# EAGLE design arm-board (EAGLE 6.5.0)

## Sheet 1 of 6: Processor
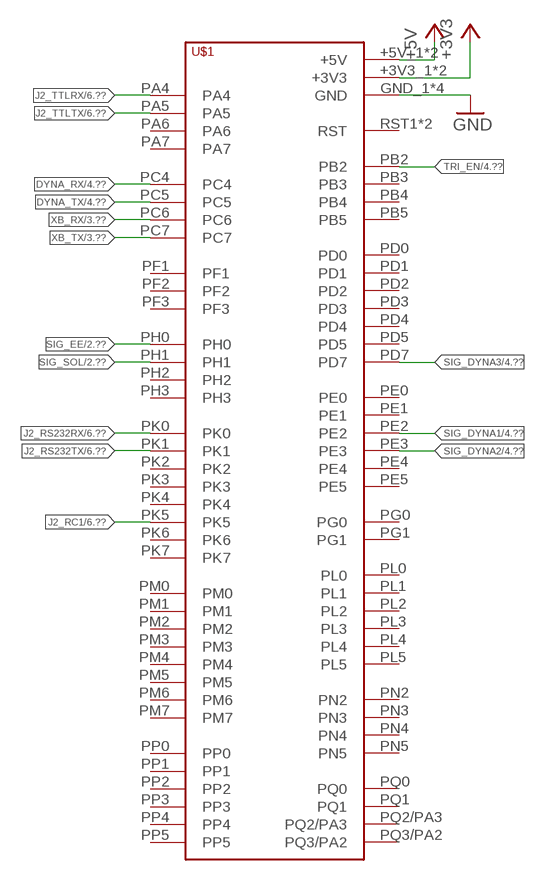
[diagram p0: schematic, sheet 1]

### Parts
U$1  TIVA-C-CONNECTED  [TIVA-C-CONNECTED]

### Nets
+3V3: U$1.+3V3_1(+3V3) U$1.+3V3_2(+3V3) ; also sheet 3
+5V: U$1.+5V_1(+5V) U$1.+5V_2(+5V) ; also sheet 2,4,5,6
DYNA_RX: U$1.PC4 ; also sheet 4
DYNA_TX: U$1.PC5 ; also sheet 4
GND: U$1.GND_1(GND) U$1.GND_2(GND) U$1.GND_3(GND) U$1.GND_4(GND) ; also sheet 2,3,4,5,6
J2_RC1: U$1.PK5 ; also sheet 6
J2_RS232RX: U$1.PK0 ; also sheet 6
J2_RS232TX: U$1.PK1 ; also sheet 6
J2_TTLRX: U$1.PA4 ; also sheet 6
J2_TTLTX: U$1.PA5 ; also sheet 6
SIG_DYNA1: U$1.PE2 ; also sheet 4
SIG_DYNA2: U$1.PE3 ; also sheet 4
SIG_DYNA3: U$1.PD7 ; also sheet 4
SIG_EE: U$1.PH0 ; also sheet 2
SIG_SOL: U$1.PH1 ; also sheet 2
TRI_EN: U$1.PB2 ; also sheet 4
XB_RX: U$1.PC6 ; also sheet 3
XB_TX: U$1.PC7 ; also sheet 3
Unconnected: U$1.PA6 U$1.PA7 U$1.PB3 U$1.PB4 U$1.PB5 U$1.PD0 U$1.PD1 U$1.PD2 U$1.PD3 U$1.PD4 U$1.PD5 U$1.PE0 U$1.PE1 U$1.PE4 U$1.PE5 U$1.PF1 U$1.PF2 U$1.PF3 U$1.PG0 U$1.PG1 U$1.PH2 U$1.PH3 U$1.PK2 U$1.PK3 U$1.PK4 U$1.PK6 U$1.PK7 U$1.PL0 U$1.PL1 U$1.PL2 U$1.PL3 U$1.PL4 U$1.PL5 U$1.PM0 U$1.PM1 U$1.PM2 U$1.PM3 U$1.PM4 U$1.PM5 U$1.PM6 U$1.PM7 U$1.PN2 U$1.PN3 U$1.PN4 U$1.PN5 U$1.PP0 U$1.PP1 U$1.PP2 U$1.PP3 U$1.PP4 U$1.PP5 U$1.PQ0 U$1.PQ1 U$1.PQ2/PA3 U$1.PQ3/PA2 U$1.RST1(RST) U$1.RST_2(RST)

## Sheet 2 of 6: Power
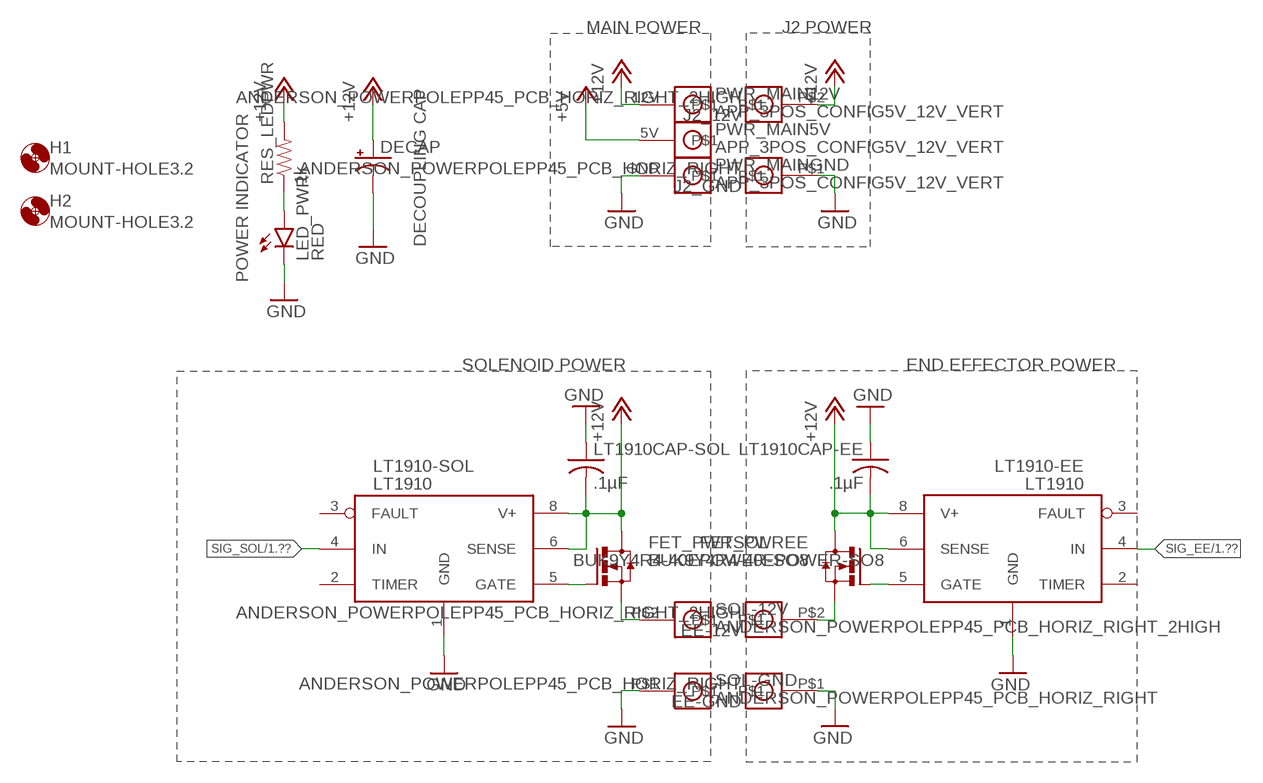
[diagram p1: schematic, sheet 2]

### Parts
DECAP  100UF-25V-20%(PTH)  [CPOL-RADIAL-100UF-25V]
EE-12V  ANDERSON_POWERPOLEPP45_PCB_HORIZ_RIGHT_2HIGH  [APP45_PCB_HORIZ_RIGHT_2HIGH]
EE-GND  ANDERSON_POWERPOLEPP45_PCB_HORIZ_RIGHT  [APP45_PCB_HORIZ_RIGHT]
FET_PWREE  BUK9Y4R4-40EPOWER-SO8  [POWER-SO8]
FET_PWRSOL  BUK9Y4R4-40EPOWER-SO8  [POWER-SO8]
H1  MOUNT-HOLE3.2  [3,2]
H2  MOUNT-HOLE3.2  [3,2]
J2_12V  ANDERSON_POWERPOLEPP45_PCB_HORIZ_RIGHT_2HIGH  [APP45_PCB_HORIZ_RIGHT_2HIGH]
J2_GND  ANDERSON_POWERPOLEPP45_PCB_HORIZ_RIGHT  [APP45_PCB_HORIZ_RIGHT]
LED_PWR  RED  LED1206  [LED-1206]
LT1910-EE  LT1910  [SO8]
LT1910-SOL  LT1910  [SO8]
LT1910CAP-EE  .1µF  C-USC1206  [C1206]
LT1910CAP-SOL  .1µF  C-USC1206  [C1206]
PWR_MAIN  APP_3POS_CONFIG5V_12V_VERT  [APP45_5V_12V_VERT_CONFIG]
RES_LEDPWR  1k  RESISTOR1206  [1206]
SOL-12V  ANDERSON_POWERPOLEPP45_PCB_HORIZ_RIGHT_2HIGH  [APP45_PCB_HORIZ_RIGHT_2HIGH]
SOL-GND  ANDERSON_POWERPOLEPP45_PCB_HORIZ_RIGHT  [APP45_PCB_HORIZ_RIGHT]

### Nets
+5V: PWR_MAIN.5V ; also sheet 1,4,5,6
+12V: DECAP.1(+) FET_PWREE.5(D) FET_PWREE.6(D) FET_PWREE.7(D) FET_PWREE.8(D) FET_PWRSOL.5(D) FET_PWRSOL.6(D) FET_PWRSOL.7(D) FET_PWRSOL.8(D) J2_12V.P$2 LT1910-EE.6(SENSE) LT1910-EE.8(V+) LT1910-SOL.6(SENSE) LT1910-SOL.8(V+) LT1910CAP-EE.2 LT1910CAP-SOL.2 PWR_MAIN.12V RES_LEDPWR.2 ; also sheet 4
GATE-EE: LT1910-EE.5(GATE)
GATE-SOL: LT1910-SOL.5(GATE)
GND: DECAP.2(-) EE-GND.P$1 J2_GND.P$1 LED_PWR.C LT1910-EE.1(GND) LT1910-SOL.1(GND) LT1910CAP-EE.1 LT1910CAP-SOL.1 PWR_MAIN.GND SOL-GND.P$1 ; also sheet 1,3,4,5,6
N$4: LED_PWR.A RES_LEDPWR.1
SIG_EE: LT1910-EE.4(IN) ; also sheet 1
SIG_SOL: LT1910-SOL.4(IN) ; also sheet 1
SOURCE-EE: EE-12V.P$2 FET_PWREE.1(S) FET_PWREE.2(S) FET_PWREE.3(S)
SOURCE-SOL: FET_PWRSOL.1(S) FET_PWRSOL.2(S) FET_PWRSOL.3(S) SOL-12V.P$2
Unconnected: FET_PWREE.4(G) FET_PWRSOL.4(G) LT1910-EE.2(TIMER) LT1910-EE.3(FAULT) LT1910-SOL.2(TIMER) LT1910-SOL.3(FAULT)

### Notes on the sheet
- MAIN POWER | J2 POWER
- DECOUPLING CAP
- POWER INDICATOR
- SOLENOID POWER | END EFFECTOR POWER

## Sheet 3 of 6: Xbee
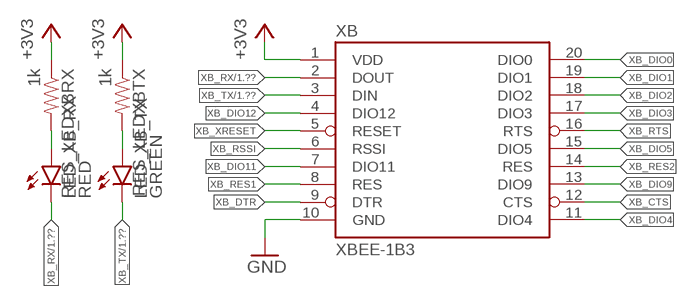
[diagram p2: schematic, sheet 3]

### Parts
LED_XB_RX  RED  LED1206  [LED-1206]
LED_XB_TX  GREEN  LED-GREEN1206  [LED-1206]
RES_LEDXBRX  1k  RESISTOR1206  [1206]
RES_LEDXBTX  1k  RESISTOR1206  [1206]
XB  XBEE-1B3  [XBEE-SMD]

### Nets
+3V3: RES_LEDXBRX.1 RES_LEDXBTX.1 XB.1(VDD) ; also sheet 1
GND: XB.10(GND) ; also sheet 1,2,4,5,6
N$1: LED_XB_RX.A RES_LEDXBRX.2
N$2: LED_XB_TX.A RES_LEDXBTX.2
XB_CTS: XB.12(CTS)
XB_DIO0: XB.20(DIO0)
XB_DIO1: XB.19(DIO1)
XB_DIO2: XB.18(DIO2)
XB_DIO3: XB.17(DIO3)
XB_DIO4: XB.11(DIO4)
XB_DIO5: XB.15(DIO5)
XB_DIO9: XB.13(DIO9)
XB_DIO11: XB.7(DIO11)
XB_DIO12: XB.4(DIO12)
XB_DTR: XB.9(DTR)
XB_RES1: XB.8(RES)
XB_RES2: XB.14(RES)
XB_RSSI: XB.6(RSSI)
XB_RTS: XB.16(RTS)
XB_RX: LED_XB_RX.C XB.2(DOUT) ; also sheet 1
XB_TX: LED_XB_TX.C XB.3(DIN) ; also sheet 1
XB_XRESET: XB.5(RESET)

## Sheet 4 of 6: Dynamixels
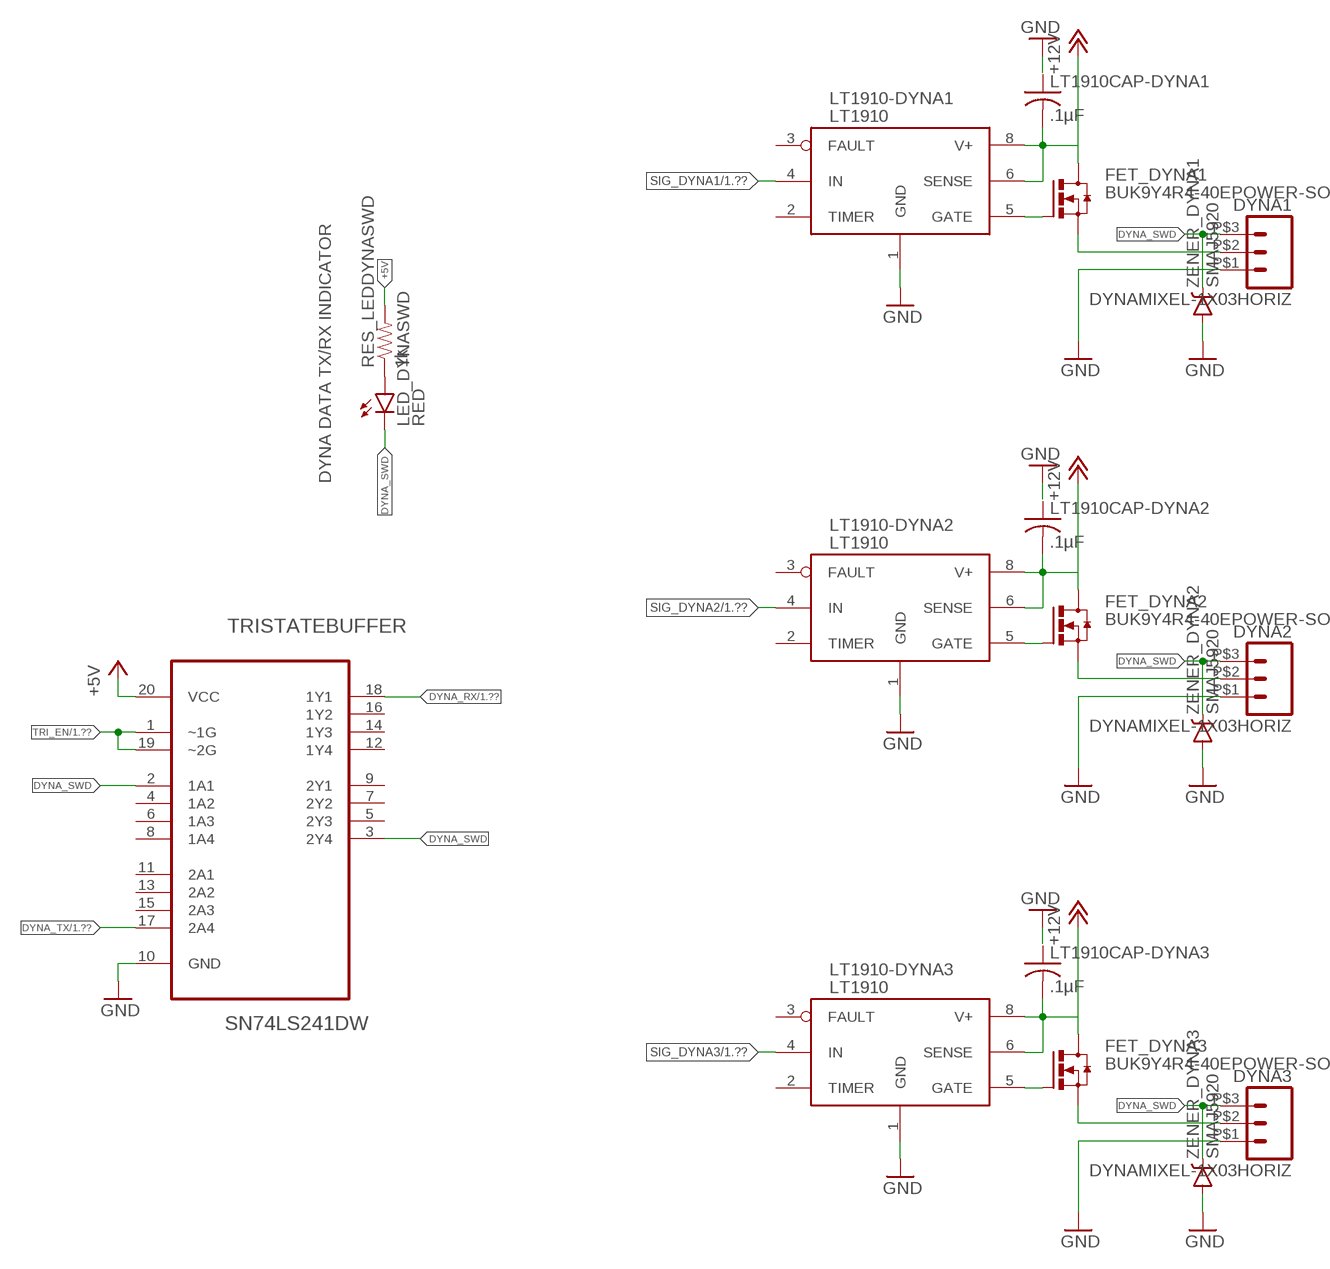
[diagram p3: schematic, sheet 4]

### Parts
DYNA1  DYNAMIXEL-1X03HORIZ  [MLX-SPOX5268-3PIN]
DYNA2  DYNAMIXEL-1X03HORIZ  [MLX-SPOX5268-3PIN]
DYNA3  DYNAMIXEL-1X03HORIZ  [MLX-SPOX5268-3PIN]
FET_DYNA1  BUK9Y4R4-40EPOWER-SO8  [POWER-SO8]
FET_DYNA2  BUK9Y4R4-40EPOWER-SO8  [POWER-SO8]
FET_DYNA3  BUK9Y4R4-40EPOWER-SO8  [POWER-SO8]
LED_DYNASWD  RED  LED1206  [LED-1206]
LT1910-DYNA1  LT1910  [SO8]
LT1910-DYNA2  LT1910  [SO8]
LT1910-DYNA3  LT1910  [SO8]
LT1910CAP-DYNA1  .1µF  C-USC1206  [C1206]
LT1910CAP-DYNA2  .1µF  C-USC1206  [C1206]
LT1910CAP-DYNA3  .1µF  C-USC1206  [C1206]
RES_LEDDYNASWD  1k  RESISTOR1206  [1206]
TRISTATEBUFFER  SN74LS241DW  [SOIC127P1030X265-20N]
ZENER_DYNA1  SMAJ5920  DIODE-SCHOTTKY-MBRA140  [SMA-DIODE]
ZENER_DYNA2  SMAJ5920  DIODE-SCHOTTKY-MBRA140  [SMA-DIODE]
ZENER_DYNA3  SMAJ5920  DIODE-SCHOTTKY-MBRA140  [SMA-DIODE]

### Nets
+5V: RES_LEDDYNASWD.2 TRISTATEBUFFER.20(VCC) ; also sheet 1,2,5,6
+12V: FET_DYNA1.5(D) FET_DYNA1.6(D) FET_DYNA1.7(D) FET_DYNA1.8(D) FET_DYNA2.5(D) FET_DYNA2.6(D) FET_DYNA2.7(D) FET_DYNA2.8(D) FET_DYNA3.5(D) FET_DYNA3.6(D) FET_DYNA3.7(D) FET_DYNA3.8(D) LT1910-DYNA1.6(SENSE) LT1910-DYNA1.8(V+) LT1910-DYNA2.6(SENSE) LT1910-DYNA2.8(V+) LT1910-DYNA3.6(SENSE) LT1910-DYNA3.8(V+) LT1910CAP-DYNA1.2 LT1910CAP-DYNA2.2 LT1910CAP-DYNA3.2 ; also sheet 2
DYNA_RX: TRISTATEBUFFER.18(1Y1) ; also sheet 1
DYNA_SWD: DYNA1.P$3 DYNA2.P$3 DYNA3.P$3 LED_DYNASWD.C TRISTATEBUFFER.2(1A1) TRISTATEBUFFER.3(2Y4) ZENER_DYNA1.C ZENER_DYNA2.C ZENER_DYNA3.C
DYNA_TX: TRISTATEBUFFER.17(2A4) ; also sheet 1
GATE-DYNA1: LT1910-DYNA1.5(GATE)
GATE-DYNA2: LT1910-DYNA2.5(GATE)
GATE-DYNA3: LT1910-DYNA3.5(GATE)
GND: DYNA1.P$1 DYNA2.P$1 DYNA3.P$1 LT1910-DYNA1.1(GND) LT1910-DYNA2.1(GND) LT1910-DYNA3.1(GND) TRISTATEBUFFER.10(GND) ZENER_DYNA1.A ZENER_DYNA2.A ZENER_DYNA3.A ; also sheet 1,2,3,5,6
N$3: LED_DYNASWD.A RES_LEDDYNASWD.1
SIG_DYNA1: LT1910-DYNA1.4(IN) ; also sheet 1
SIG_DYNA2: LT1910-DYNA2.4(IN) ; also sheet 1
SIG_DYNA3: LT1910-DYNA3.4(IN) ; also sheet 1
SOURCE-DYNA1: DYNA1.P$2 FET_DYNA1.1(S) FET_DYNA1.2(S) FET_DYNA1.3(S)
SOURCE-DYNA2: DYNA2.P$2 FET_DYNA2.1(S) FET_DYNA2.2(S) FET_DYNA2.3(S)
SOURCE-DYNA3: DYNA3.P$2 FET_DYNA3.1(S) FET_DYNA3.2(S) FET_DYNA3.3(S)
TRI_EN: TRISTATEBUFFER.1(~1G) TRISTATEBUFFER.19(~2G) ; also sheet 1
Unconnected: FET_DYNA1.4(G) FET_DYNA2.4(G) FET_DYNA3.4(G) LT1910-DYNA1.2(TIMER) LT1910-DYNA1.3(FAULT) LT1910-DYNA2.2(TIMER) LT1910-DYNA2.3(FAULT) LT1910-DYNA3.2(TIMER) LT1910-DYNA3.3(FAULT) LT1910CAP-DYNA1.1 LT1910CAP-DYNA2.1 LT1910CAP-DYNA3.1 TRISTATEBUFFER.4(1A2) TRISTATEBUFFER.5(2Y3) TRISTATEBUFFER.6(1A3) TRISTATEBUFFER.7(2Y2) TRISTATEBUFFER.8(1A4) TRISTATEBUFFER.9(2Y1) TRISTATEBUFFER.11(2A1) TRISTATEBUFFER.12(1Y4) TRISTATEBUFFER.13(2A2) TRISTATEBUFFER.14(1Y3) TRISTATEBUFFER.15(2A3) TRISTATEBUFFER.16(1Y2)

### Notes on the sheet
- DYNA DATA TX/RX INDICATOR

## Sheet 5 of 6: Encoders
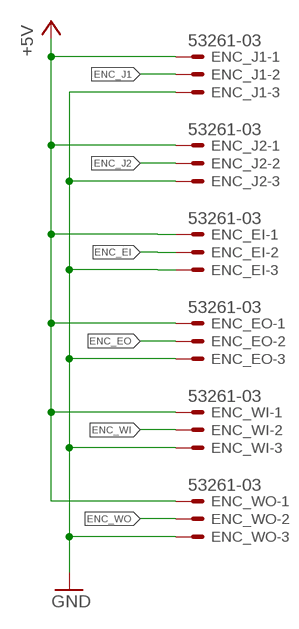
[diagram p4: schematic, sheet 5]

### Parts
ENC_EI  53261-03  [53261-03]
ENC_EO  53261-03  [53261-03]
ENC_J1  53261-03  [53261-03]
ENC_J2  53261-03  [53261-03]
ENC_WI  53261-03  [53261-03]
ENC_WO  53261-03  [53261-03]

### Nets
+5V: ENC_EI.1 ENC_EO.1 ENC_J1.1 ENC_J2.1 ENC_WI.1 ENC_WO.1 ; also sheet 1,2,4,6
ENC_EI: ENC_EI.2
ENC_EO: ENC_EO.2
ENC_J1: ENC_J1.2
ENC_J2: ENC_J2.2
ENC_WI: ENC_WI.2
ENC_WO: ENC_WO.2
GND: ENC_EI.3 ENC_EO.3 ENC_J1.3 ENC_J2.3 ENC_WI.3 ENC_WO.3 ; also sheet 1,2,3,4,6

## Sheet 6 of 6: J2
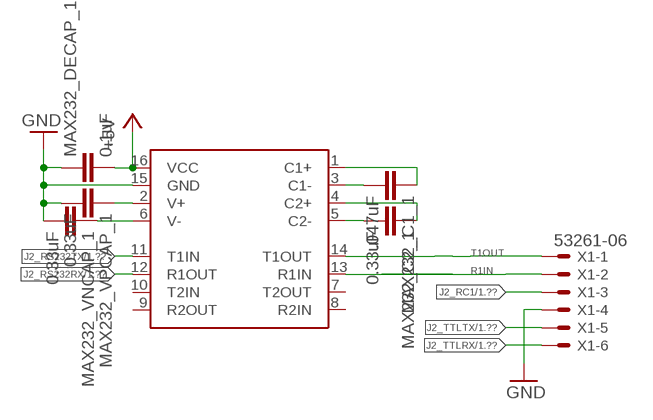
[diagram p5: schematic, sheet 6]

### Parts
MAX232_1  MAX3232SO16  [SO16]
MAX232_C1_1  .047uF  CAP1206  [1206]
MAX232_C2_1  0.33uF  CAP1206  [1206]
MAX232_DECAP_1  0.1uF  CAP1206  [1206]
MAX232_VNCAP_1  0.33uF  CAP1206  [1206]
MAX232_VPCAP_1  0.33uF  CAP1206  [1206]
X1  53261-06  [53261-06]

### Nets
+5V: MAX232_1.16(VCC) MAX232_DECAP_1.2 ; also sheet 1,2,4,5
GND: MAX232_1.15(GND) MAX232_DECAP_1.1 MAX232_VNCAP_1.2 MAX232_VPCAP_1.2 X1.4 ; also sheet 1,2,3,4,5
J2_RC1: X1.3 ; also sheet 1
J2_RS232RX: MAX232_1.12(R1OUT) ; also sheet 1
J2_RS232TX: MAX232_1.11(T1IN) ; also sheet 1
J2_TTLRX: X1.6 ; also sheet 1
J2_TTLTX: X1.5 ; also sheet 1
N$1_1: MAX232_1.1(C1+) MAX232_C1_1.1
N$2_1: MAX232_1.2(V+) MAX232_VPCAP_1.1
N$3_1: MAX232_1.3(C1-) MAX232_C1_1.2
N$4_1: MAX232_1.4(C2+) MAX232_C2_1.1
N$5_1: MAX232_1.5(C2-) MAX232_C2_1.2
N$6_1: MAX232_1.6(V-) MAX232_VNCAP_1.1
R1IN: MAX232_1.13(R1IN) X1.2
T1OUT: MAX232_1.14(T1OUT) X1.1
Unconnected: MAX232_1.7(T2OUT) MAX232_1.8(R2IN) MAX232_1.9(R2OUT) MAX232_1.10(T2IN)

## Library data of the parts
DECAP = SparkFun-Capacitors:100UF-25V-20%(PTH): CAP-08439; PROD_ID: CAP-08439
DYNA1-DYNA3 = MRDT-2015-Arm:DYNAMIXEL-1X03; MFR: Molex; MFR_PN: 0022057035; ORIENT: Horiz
EE-12V EE-GND J2_12V J2_GND SOL-12V SOL-GND = MRDT-Connectors:ANDERSON_POWERPOLE: http://www.powerwerx.com/anderson-powerpoles/
ENC_EI ENC_EO ENC_J1 ENC_J2 ENC_WI ENC_WO = con-molex:53?-03: CONNECTOR wire to board 1.25 mm (.049 inch) pitch header; MF: MOLEX; MPN: 53261-0390; OC_FARNELL: 1125359; OC_NEWARK: 57H5006
FET_DYNA1-FET_DYNA3 FET_PWREE FET_PWRSOL = MRDT-2015-General:BUK9Y4R4-40E; MFR: NXP; MFR_PN: BUK9Y4R4-40E; PACKAGE: POWER-SO8
H1 H2 = holes:MOUNT-HOLE: MOUNTING HOLE with drill center marker
LED_DYNASWD LED_PWR LED_XB_RX = SparkFun-LED:LED: LEDs Standard schematic elements and footprints for 5mm, 3mm, 1206, and 0603 sized LEDs. 5mm - Spark Fun Electronics SKU : COM-00529 (and others)
LED_XB_TX = SparkFun-LED:LED-GREEN: Various green LEDs Green LEDs used in SFE Production 0603- DIO-00821 LARGE- DIO-00862 LILYPAD- DIO-09910; PROD_ID: DIO-00862
LT1910-DYNA1-LT1910-DYNA3 LT1910-EE LT1910-SOL = Jake:LT1910
LT1910CAP-DYNA1-LT1910CAP-DYNA3 LT1910CAP-EE LT1910CAP-SOL = resistor:C-US: CAPACITOR, American symbol
MAX232_1 = MRDT-Digital-ICs:MAX3232: MAX3232 RS232 Transceiver http://pdfserv.maximintegrated.com/en/ds/MAX3222-MAX3241.pdf
MAX232_C1_1 MAX232_C2_1 MAX232_DECAP_1 MAX232_VNCAP_1 MAX232_VPCAP_1 = SparkFun-Capacitors:CAP: Capacitor Standard 0603 ceramic capacitor, and 0.1" leaded capacitor.
PWR_MAIN = MRDT-Connectors:APP_3POS_CONFIG; COLOR1: YELLOW; COLOR2: RED; COLOR3: BLACK
RES_LEDDYNASWD = SparkFun-Resistors:RESISTOR: Resistor Basic schematic elements and footprints for 0603, 1206, and PTH resistors.
RES_LEDPWR RES_LEDXBRX RES_LEDXBTX = SparkFun-Passives:RESISTOR: Resistor Basic schematic elements and footprints for 0603, 1206, and PTH resistors.
TRISTATEBUFFER = 74LS241:SN74LS241DW: OCTAL BUFFERS AND LINE DRIVERS WITH 3-STATE OUTPUTS; MPN: SN74LS241DW; OC_FARNELL: 1739687; OC_NEWARK: 50R6539; PACKAGE: SOIC-20; SUPPLIER: Texas Instruments
U$1 = MRDT-2015-General:TIVA-C-CONNECTED: TIVA C CONNECTED LAUNCHPAD
X1 = con-molex:53?-06: CONNECTOR wire to board 1.25 mm (.049 inch) pitch header; OC_FARNELL: 1125375; OC_NEWARK: unknown
XB = SparkFun:XBEE-1
ZENER_DYNA1-ZENER_DYNA3 = SparkFun-DiscreteSemi:DIODE-SCHOTTKY: Schottky diodes in SFE's production catalog BAT20J 1A 23V 0.62Vf RB751 120mA 40V 0.37Vf PMEG4005EJ 0.5A 40V 0.42Vf MBRA140 1A 40V 0.5Vf B340A 3A 40V SMA; PROD_ID: DIO-08053; VALUE: MBRA140

## Board
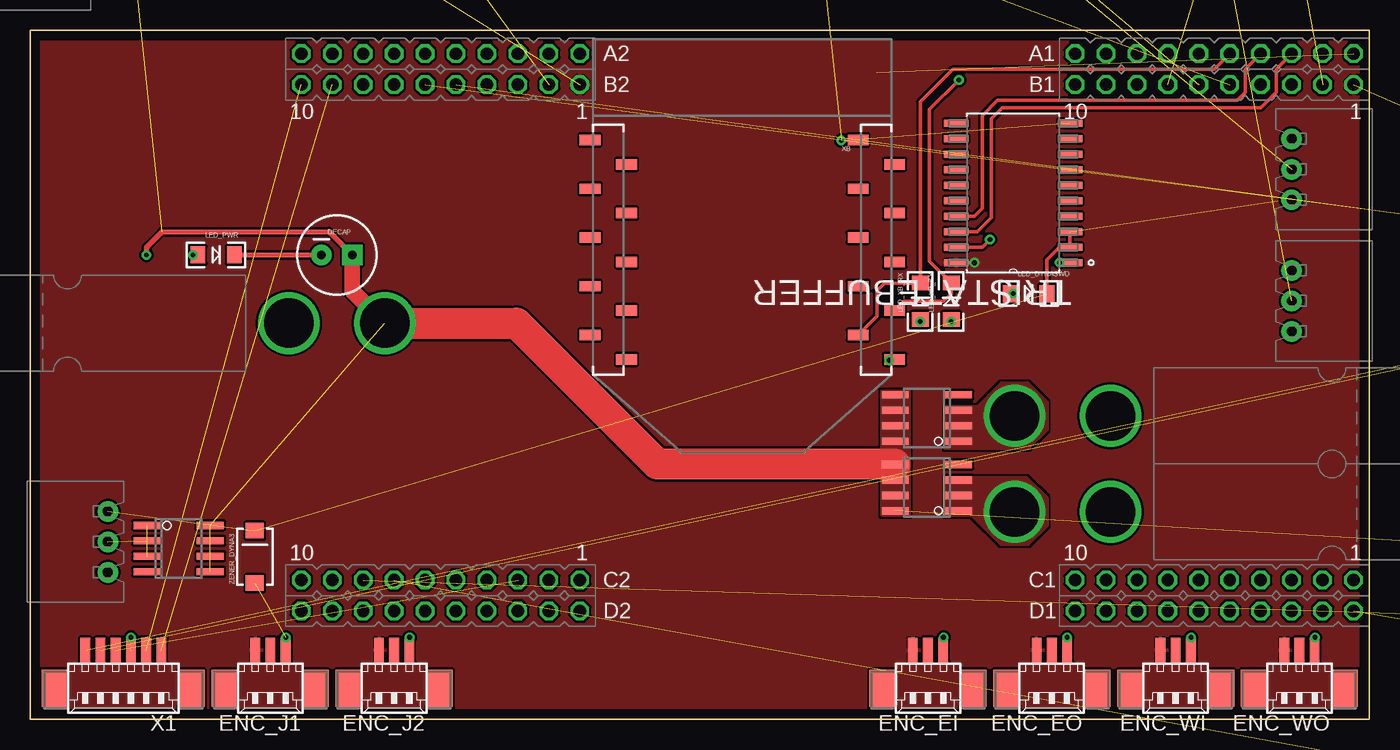
[diagram p6: board, top side]
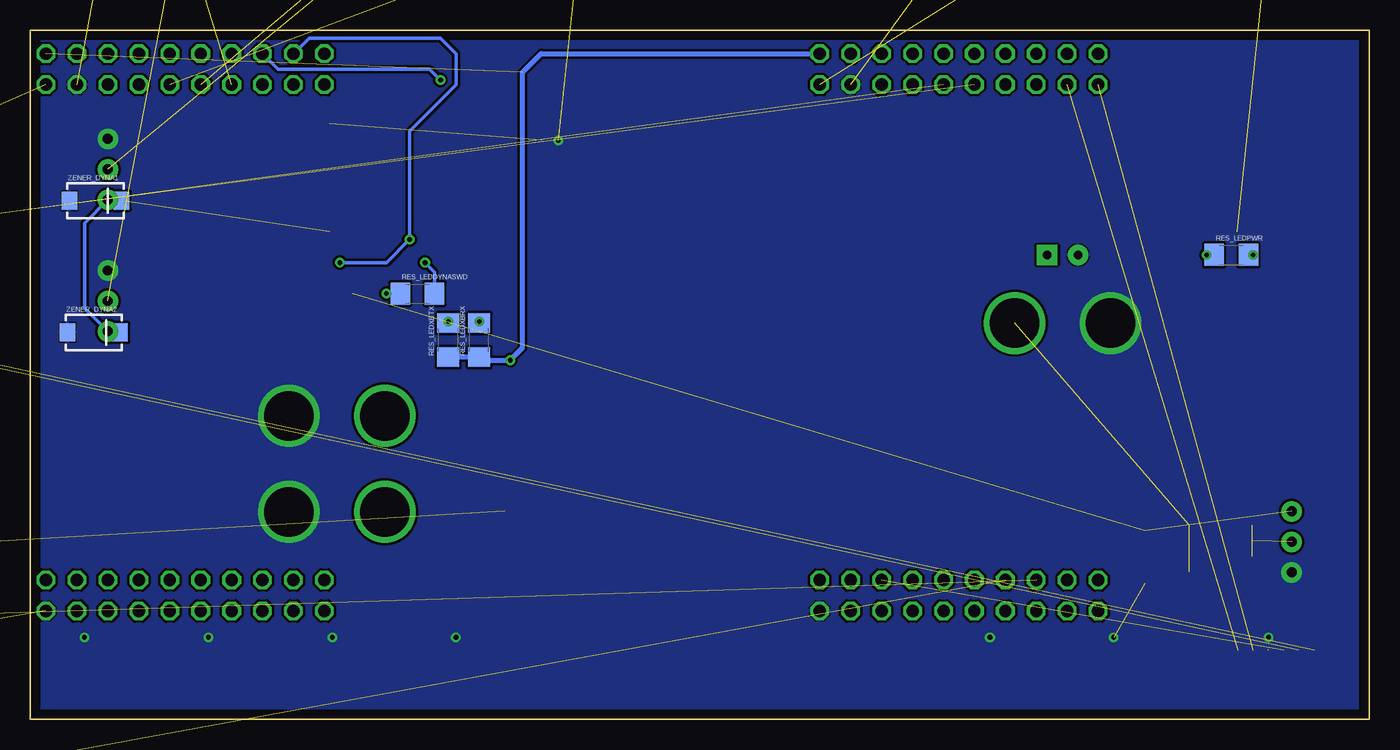
[diagram p7: board, bottom side, seen from below]

Size 109.85 x 56.52 mm. Coordinates in mm from the lower left corner, seen from the top.
Outline: 109.85,56.52 109.85,0 0,0 0,56.52 109.85,56.52
Copper layers (1*16): Top 0.035mm / dielectric 1.5mm / Bottom 0.035mm
Design rules "default *": minimum track width 10mil, minimum drill 19mil, track to track 8mil, track to pad 8mil, pad to pad 8mil, via to via 8mil, smd to smd 8mil, copper to edge 30mil, drill to drill 8mil, minimum pad ring 10mil, minimum via ring 8mil, stop-mask expansion 4mil, vias tented up to drill 0mil, thermal gap 5mil

### Footprints (pad centres in the part's own frame; a part is rotated, then mirrored left to right if it is on the bottom)
CPOL-RADIAL-100UF-25V = drill 0.7 pad 1.651 square: 1 1.27,0 | drill 0.7 pad 1.651: 2 -1.27,0
MLX-SPOX5268-3PIN = drill 0.8 pad 1.676: P$1 0,0; P$2 2.5,0; P$3 5,0
APP45_PCB_HORIZ_RIGHT_2HIGH = drill 4.064: P$2 36.068,3.937
APP45_PCB_HORIZ_RIGHT = drill 4.064: P$1 28.194,3.937
53261-03 = smd 0.8 x 2: 1 1.25,-2.5; 2 0,-2.5; 3 -1.25,-2.5 | smd 2.1 x 3: S1 3.75,0.625; S2 -3.75,0.625
POWER-SO8 = smd 0.6 x 2.2: 1 0.595,-0.6; 2 1.865,-0.6; 3 3.135,-0.6; 4 4.405,-0.6; 5 4.405,4.6; 6 3.135,4.6; 7 1.865,4.6; 8 0.595,4.6
3,2 = hole 3.2: 0,0
LED-1206 = smd 1.2 x 1.4: A -1.5,0; C 1.5,0
SO8 = smd 0.6 x 2.2: 1 -1.905,-2.6; 2 -0.635,-2.6; 3 0.635,-2.6; 4 1.905,-2.6; 5 1.905,2.6; 6 0.635,2.6; 7 -0.635,2.6; 8 -1.905,2.6
C1206 = smd 1.6 x 1.8: 1 -1.4,0; 2 1.4,0
SO16 = smd 0.6 x 1.2: 1 -4.445,-2.8; 2 -3.175,-2.8; 3 -1.905,-2.8; 4 -0.635,-2.8; 5 0.635,-2.8; 6 1.905,-2.8; 7 3.175,-2.8; 8 4.445,-2.8; 9 4.445,2.8; 10 3.175,2.8; 11 1.905,2.8; 12 0.635,2.8; 13 -0.635,2.8; 14 -1.905,2.8; 15 -3.175,2.8; 16 -4.445,2.8
1206 = smd 1.6 x 1.8: 1 -1.4,0; 2 1.4,0
APP45_5V_12V_HORIZ_CONFIG = drill 4.064: 5V 36.068,3.937; 12V 28.194,-3.937; GND 28.194,3.937
SOIC127P1030X265-20N = smd 1.981 x 0.559: 1 -4.674,5.715; 2 -4.674,4.445; 3 -4.674,3.175; 4 -4.674,1.905; 5 -4.674,0.635; 6 -4.674,-0.635; 7 -4.674,-1.905; 8 -4.674,-3.175; 9 -4.674,-4.445; 10 -4.674,-5.715; 11 4.674,-5.715; 12 4.674,-4.445; 13 4.674,-3.175; 14 4.674,-1.905; 15 4.674,-0.635; 16 4.674,0.635; 17 4.674,1.905; 18 4.674,3.175; 19 4.674,4.445; 20 4.674,5.715
TIVA-C-CONNECTED = drill 1.016 octagon: +3V3_1 59.69,54.61; +3V3_2 123.19,54.61; +5V_1 59.69,52.07; +5V_2 123.19,52.07; GND_1 57.15,52.07; GND_2 59.69,8.89; GND_3 120.65,52.07; GND_4 123.19,8.89; PA4 39.37,52.07; PA5 36.83,52.07; PA6 105.41,52.07; PA7 52.07,8.89; PB2 102.87,54.61; PB3 100.33,54.61; PB4 54.61,52.07; PB5 52.07,52.07; PC4 118.11,54.61; PC5 115.57,54.61; PC6 113.03,54.61; PC7 105.41,54.61; PD0 107.95,8.89; PD1 110.49,8.89; PD2 57.15,54.61; PD3 107.95,54.61; PD4 49.53,54.61; PD5 46.99,54.61; PD7 107.95,52.07; PE0 118.11,52.07; PE1 115.57,52.07; PE2 113.03,52.07; PE3 110.49,52.07; PE4 120.65,54.61; PE5 110.49,54.61; PF1 123.19,11.43; PF2 120.65,11.43; PF3 118.11,11.43; PG0 115.57,11.43; PG1 59.69,11.43; PH0 44.45,11.43; PH1 41.91,11.43; PH2 118.11,8.89; PH3 115.57,8.89; PK0 49.53,52.07; PK1 46.99,52.07; PK2 44.45,52.07; PK3 41.91,52.07; PK4 57.15,11.43; PK5 54.61,11.43; PK6 39.37,11.43; PK7 36.83,11.43; PL0 107.95,11.43; PL1 105.41,11.43; PL2 102.87,11.43; PL3 100.33,11.43; PL4 113.03,11.43; PL5 110.49,11.43; PM0 52.07,11.43; PM1 49.53,11.43; PM2 46.99,11.43; PM3 120.65,8.89; PM4 102.87,52.07; PM5 100.33,52.07; PM6 36.83,8.89; PM7 57.15,8.89; PN2 105.41,8.89; PN3 102.87,8.89; PN4 36.83,54.61; PN5 39.37,54.61; PP0 54.61,54.61; PP1 52.07,54.61; PP2 100.33,8.89; PP3 41.91,8.89; PP4 41.91,54.61; PP5 54.61,8.89; PQ0 44.45,54.61; PQ1 39.37,8.89; PQ2/PA3 46.99,8.89; PQ3/PA2 44.45,8.89; RST1 49.53,8.89; RST_2 113.03,8.89
53261-06 = smd 0.8 x 2: 1 3.125,-2.5; 2 1.875,-2.5; 3 0.625,-2.5; 4 -0.625,-2.5; 5 -1.875,-2.5; 6 -3.125,-2.5 | smd 2.1 x 3: S1 5.625,0.625; S2 -5.625,0.625
XBEE-SMD = smd 1.7 x 0.85: 1 -12.5,20; 2 -9.5,18; 3 -12.5,16; 4 -9.5,14; 5 -12.5,12; 6 -9.5,10; 7 -12.5,8; 8 -9.5,6; 9 -12.5,4; 10 -9.5,2; 11 12.5,2; 12 9.5,4; 13 12.5,6; 14 9.5,8; 15 12.5,10; 16 9.5,12; 17 12.5,14; 18 9.5,16; 19 12.5,18; 20 9.5,20
SMA-DIODE = smd 1.27 x 1.47: A -2.15,0; C 2.15,0

### Placement (x,y rotation side)
DECAP  25.15,38.1 0 top
DYNA1  6.35,12.07 90 top
DYNA2  103.5,47.62 270 top
DYNA3  103.5,36.83 270 top
EE-12V  116.84,28.83 180 top
EE-GND  116.84,28.83 180 top
ENC_EI  73.66,3.17 180 top
ENC_EO  83.82,3.17 180 top
ENC_J1  19.68,3.17 180 top
ENC_J2  29.85,3.17 180 top
ENC_WI  93.98,3.17 180 top
ENC_WO  104.14,3.17 180 top
FET_DYNA1  10.16,16.51 270 top
FET_DYNA2  55.24,83.82 90 top  (outside the outline)
FET_DYNA3  93.34,83.82 90 top  (outside the outline)
FET_PWREE  75.56,22.23 90 top
FET_PWRSOL  75.56,16.51 90 top
H1  135.89,10.16 0 top  (outside the outline)
H2  123.19,40.64 0 top  (outside the outline)
J2_12V  -6.99,28.58 0 top
J2_GND  -6.99,28.58 0 top
LED_DYNASWD  81.91,34.92 0 top
LED_PWR  15.24,38.1 0 top
LED_XB_RX  73.02,34.29 90 top
LED_XB_TX  75.56,34.29 90 top
LT1910-DYNA1  22.86,77.47 90 top  (outside the outline)
LT1910-DYNA2  60.96,77.47 90 top  (outside the outline)
LT1910-DYNA3  99.06,77.47 90 top  (outside the outline)
LT1910-EE  146.05,-7.62 0 top  (outside the outline)
LT1910-SOL  146.05,10.16 0 top  (outside the outline)
LT1910CAP-DYNA1  29.85,74.93 90 top  (outside the outline)
LT1910CAP-DYNA2  67.94,74.93 90 top  (outside the outline)
LT1910CAP-DYNA3  106.05,74.93 90 top  (outside the outline)
LT1910CAP-EE  143.51,-14.6 0 top  (outside the outline)
LT1910CAP-SOL  143.51,3.17 0 top  (outside the outline)
MAX232_1  148.59,33.66 0 top  (outside the outline)
MAX232_C1_1  150.5,24.13 0 top  (outside the outline)
MAX232_C2_1  143.51,20.32 0 top  (outside the outline)
MAX232_DECAP_1  143.51,27.94 0 top  (outside the outline)
MAX232_VNCAP_1  150.5,27.94 0 top  (outside the outline)
MAX232_VPCAP_1  143.51,24.13 0 top  (outside the outline)
PWR_MAIN  APP_3POS_CONFIG5V_12V_HORIZ  [APP45_5V_12V_HORIZ_CONFIG]  -19.69,66.04 0 top  (outside the outline)
RES_LEDDYNASWD  78.1,34.92 0 bottom
RES_LEDPWR  11.3,38.1 0 bottom
RES_LEDXBRX  73.02,31.12 90 bottom
RES_LEDXBTX  75.56,31.12 90 bottom
SOL-12V  116.84,20.95 180 top
SOL-GND  116.84,20.95 180 top
TRISTATEBUFFER  80.64,43.18 180 top
U$1  -14.61,0 0 top
X1  7.62,3.17 180 top
XB  58.42,49.53 180 top
ZENER_DYNA1  104.52,42.55 0 bottom
ZENER_DYNA2  104.65,31.75 0 bottom
ZENER_DYNA3  18.42,13.34 90 top

### Tracks (layer width: path | path; a pad name or v marks a point on that pad's centre or on a via)
+3V3  (via drill 0.38)  (1 unrouted)
  Top 0.406: v70.48,29.46 70.55,29.53 XB.1
  Bottom 0.406: RES_LEDXBTX.1 73.41,29.72 73.41,30.1 RES_LEDXBRX.1 73.02,29.46 v70.48,29.46 69.47,30.48 69.47,53.09 67.94,54.61 U$1.+3V3_1
+5V  (via drill 0.38)  (3 unrouted)
  Top 0.305: v77.47,37.46 TRISTATEBUFFER.20
  Bottom 0.305: RES_LEDDYNASWD.2 76.7,36.7 v77.47,37.46
  pour Top (rank 6): -17.78,-3.81 116.2,-3.81 116.2,60.32 -17.78,60.32
+12V  (via drill 0.38)  (28 unrouted)
  Top 0.406: v9.52,38.1 9.52,38.73 10.79,40 24.51,40 DECAP.1
  Top 1.27: DECAP.1 26.42,35.18 J2_12V.P$2
  Top 2.54: J2_12V.P$2 39.88,32.51 51.44,20.95 70.92,20.95 FET_PWRSOL.5
  Bottom 0.406: v9.52,38.1 RES_LEDPWR.2
  pour Top (no thermals): 69.85,16.76 72.14,16.76 72.14,26.92 69.85,26.92
DYNA_RX
  Top 0.305: TRISTATEBUFFER.18 77.72,40 78.87,41.15 78.87,49.28 79.76,50.16 100.96,50.16 102.23,51.43 102.23,53.34 U$1.PC4
DYNA_SWD  (3 unrouted)
  Top 0.305: TRISTATEBUFFER.3 TRISTATEBUFFER.2 84.45,38.73 83.41,37.7 LED_DYNASWD.C
  Bottom 0.305: ZENER_DYNA2.C 103.42,31.75 DYNA3.P$3 105.41,33.73 105.41,40.72 DYNA2.P$3 103.42,42.55 ZENER_DYNA1.C
DYNA_TX
  Top 0.305: TRISTATEBUFFER.17 77.47,41.27 78.1,41.91 78.1,49.53 79.38,50.8 99.06,50.8 99.69,51.43 99.69,53.34 U$1.PC5
GND  (via drill 0.38)  (15 unrouted)
  Top 0.305: v66.55,47.5 67.89,47.5 XB.10 | v74.93,6.73 74.93,5.7 ENC_EI.3 | v105.41,6.73 105.41,5.7 ENC_WO.3 | v95.25,6.73 95.25,5.7 ENC_WI.3 | v85.09,6.73 85.09,5.7 ENC_EO.3 | v31.11,6.73 31.11,5.7 ENC_J2.3 | v20.96,6.73 20.96,5.7 ENC_J1.3 | v8.25,6.73 8.25,5.7 X1.4
  Top 0.406: LED_PWR.C DECAP.2
  pour Bottom (rank 6): -23.5,57.78 -23.5,-7.62 112.39,-7.62 112.39,57.78
J2_RC1  (1 unrouted)
J2_RS232RX  (1 unrouted)
J2_RS232TX  (1 unrouted)
J2_TTLRX  (1 unrouted)
J2_TTLTX  (1 unrouted)
N$1  (via drill 0.38)
  Top 0.406: LED_XB_RX.A v73.02,32.64
  Bottom 0.406: RES_LEDXBRX.2 v73.02,32.64
N$1_1  (1 unrouted)
N$2  (via drill 0.38)
  Top 0.406: LED_XB_TX.A v75.56,32.64
  Bottom 0.406: RES_LEDXBTX.2 v75.56,32.64
N$2_1  (1 unrouted)
N$3  (via drill 0.38)
  Top 0.305: v80.64,34.92 LED_DYNASWD.A
  Bottom 0.305: RES_LEDDYNASWD.1 v80.64,34.92
N$3_1  (1 unrouted)
N$4  (via drill 0.38)
  Top 0.406: v13.34,38.1 LED_PWR.A
  Bottom 0.406: RES_LEDPWR.1 v13.34,38.1
N$4_1  (1 unrouted)
N$5_1  (1 unrouted)
N$6_1  (1 unrouted)
R1IN  (1 unrouted)
SIG_DYNA1  (1 unrouted)
SIG_DYNA2  (1 unrouted)
SIG_DYNA3  (1 unrouted)
SIG_EE  (1 unrouted)
SIG_SOL  (1 unrouted)
SOURCE-DYNA1  (3 unrouted)
SOURCE-DYNA2  (3 unrouted)
SOURCE-DYNA3  (3 unrouted)
SOURCE-EE
  pour Top (no thermals): 80.64,22.23 81.91,22.23 83.44,23.75 83.44,26.03 81.91,27.56 79.63,27.56 77.72,25.65 75.06,25.65 75.06,22.23
SOURCE-SOL
  pour Top (no thermals): 80.64,14.35 81.91,14.35 83.44,15.88 83.44,18.16 81.91,19.69 81.79,19.81 75.06,19.81 75.06,16.76 77.22,16.76 79.63,14.35
T1OUT  (1 unrouted)
TRI_EN  (via drill 0.38)
  Top 0.305: TRISTATEBUFFER.19 78.1,38.73 v78.74,39.37 | v84.45,37.46 TRISTATEBUFFER.1
  Bottom 0.305: U$1.PB2 86.99,55.88 76.2,55.88 74.93,54.61 74.93,52.07 78.74,48.26 v78.74,39.37 80.64,37.46 v84.45,37.46
XB_RX
  Top 0.305: XB.2 69.47,33.08 69.47,35.18 70.08,35.79 LED_XB_RX.C 73.02,50.67 75.69,53.34 97.16,53.34 U$1.PC6
XB_TX  (via drill 0.38)
  Top 0.305: XB.3 71.68,34.29 74.93,34.29 75.56,34.92 LED_XB_TX.C 75.56,35.81 73.79,37.59 73.79,50.04 v76.2,52.45
  Bottom 0.305: v76.2,52.45 77.09,53.34 89.53,53.34 U$1.PC7